# Altium schematic sheet Main.SchDoc: ThunderScope 1000E
size A4; DrawnBy: Aleksa Bjelogrlic; Revision: 1
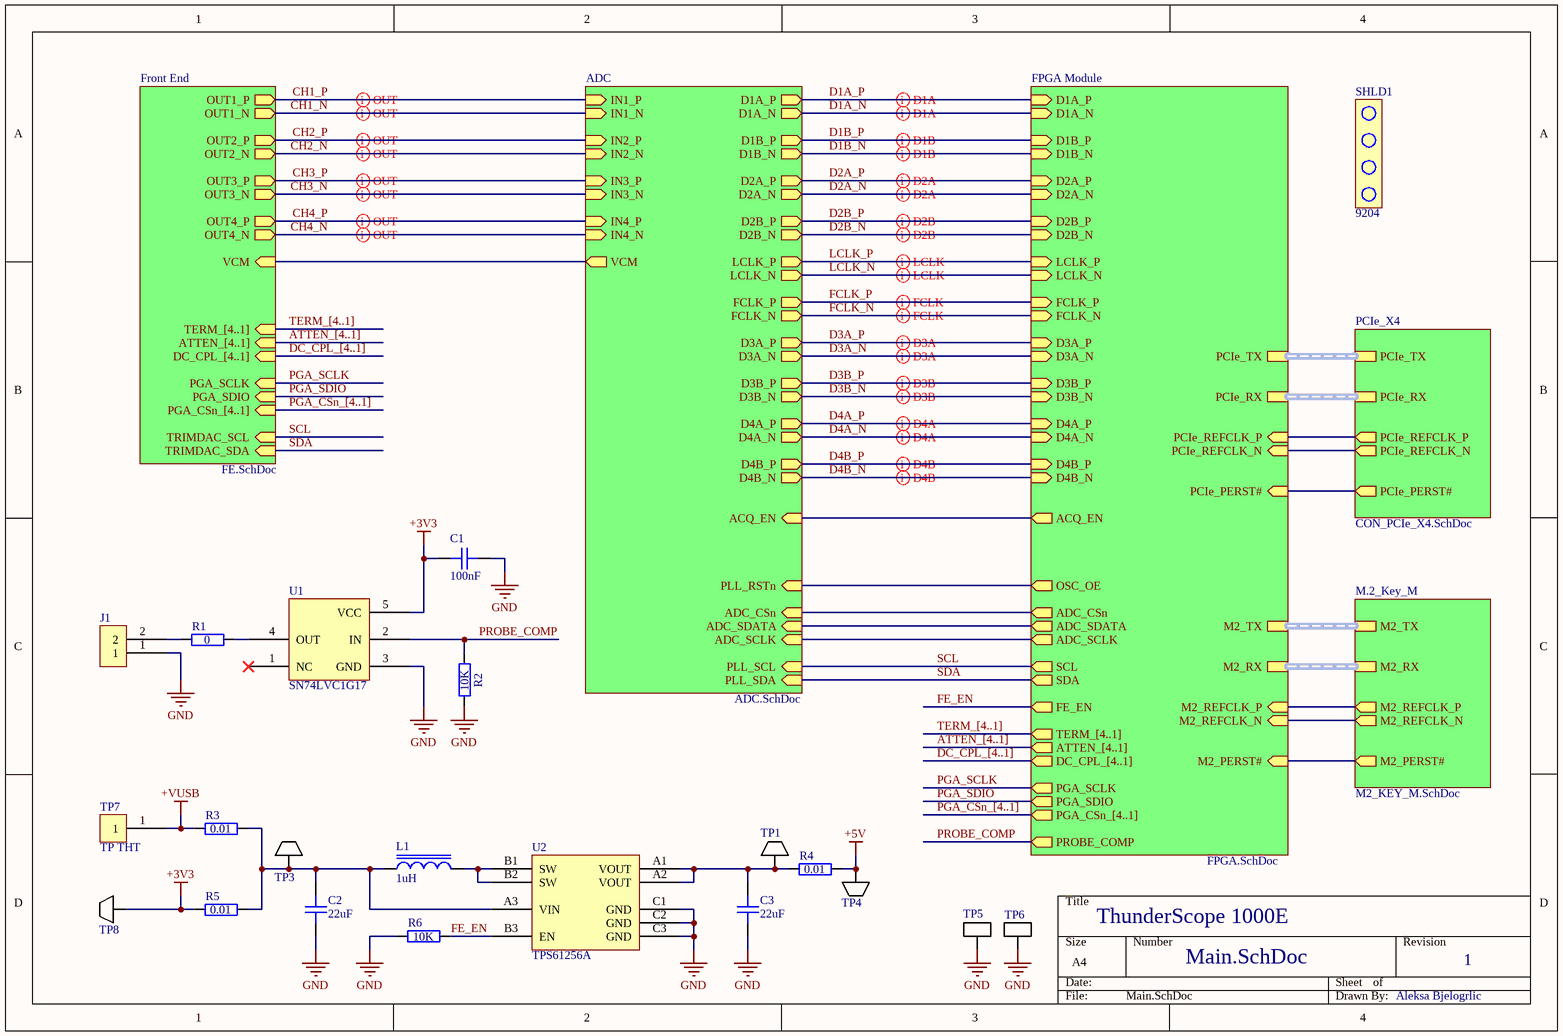
[diagram p0: Main.SchDoc]

## Parts
C1  100nF  [GEN_C_0402]
C2  22uF  [GEN_C_0805]
C3  22uF  [GEN_C_0805]
J1  TSW-101-08-F-D-RA  [GEN_2.54mm_1x2_Pin_TH_RA]  (value not drawn)
L1  1uH  [GEN_L_1210]
R1  0  [GEN_R_0402]
R2  10K  [GEN_R_0402]
R3  0.01  [GEN_R_0603]
R4  0.01  [GEN_R_0603]
R5  0.01  [GEN_R_0603]
R6  10K  [GEN_R_0402]
SHLD1  9204  (mechanical)
TP1  5015  [KEY_5015]  (value not drawn)
TP3  5015  [KEY_5015]  (value not drawn)
TP4  5015  [KEY_5015]  (value not drawn)
TP5  5019  [KEY_5019]  (value not drawn)
TP6  5019  [KEY_5019]  (value not drawn)
TP7  TP THT  [GEN_1_Pin_TH_TP]
TP8  5015  [KEY_5015]  (value not drawn)
U1  SN74LVC1G17  [GEN_SC-70-5]
U2  TPS61256A  [TI_DSBGA_YFF0009]

## Sub-sheets
ADC = ADC.SchDoc: IN4_N (in), IN4_P (in), IN3_N (in), IN3_P (in), IN2_N (in), IN2_P (in), VCM (out), IN1_N (in), IN1_P (in), ADC_CSn (in), ADC_SDATA (in), ADC_SCLK (in), D1A_N (out), D1A_P (out), D1B_P (out), D1B_N (out), D2A_P (out), D2A_N (out), D2B_N (out), D2B_P (out), LCLK_P (out), LCLK_N (out), FCLK_N (out), FCLK_P (out), D3A_P (out), D3A_N (out), D3B_P (out), D3B_N (out), D4A_P (out), D4A_N (out), D4B_P (out), D4B_N (out), ACQ_EN (in), PLL_RSTn (in), PLL_SDA (in), PLL_SCL (in)
FPGA Module = FPGA.SchDoc: D1A_P (in), D1A_N (in), D1B_P (in), D1B_N (in), D2A_P (in), D2A_N (in), D2B_P (in), D2B_N (in), LCLK_P (in), LCLK_N (in), FCLK_P (in), FCLK_N (in), D3A_P (in), D3A_N (in), D3B_P (in), D3B_N (in), D4A_P (in), D4A_N (in), D4B_P (in), D4B_N (in), ACQ_EN (out), OSC_OE (out), ADC_CSn (out), ADC_SDATA (out), ADC_SCLK (out), SCL (out), SDA (out), FE_EN (out), ATTEN_[4..1] (out), DC_CPL_[4..1] (out), PGA_SCLK (out), PGA_SDIO (out), PGA_CSn_[4..1] (out), PROBE_COMP (out), PCIe_REFCLK_N (in), PCIe_PERST# (in), PCIe_REFCLK_P (in), PCIe_TX (harness PCIe_X4_TX), PCIe_RX (harness PCIe_X4_RX), M2_REFCLK_N (in), M2_PERST# (in), M2_REFCLK_P (in), M2_TX (harness M2_X4_TX), M2_RX (harness M2_X4_RX), TERM_[4..1] (out)
Front End = FE.SchDoc: OUT1_P (out), OUT1_N (out), OUT3_P (out), OUT3_N (out), OUT4_N (out), OUT2_N (out), OUT2_P (out), OUT4_P (out), VCM (in), DC_CPL_[4..1] (in), ATTEN_[4..1] (in), PGA_SCLK (in), PGA_CSn_[4..1] (in), PGA_SDIO (in), TRIMDAC_SCL (in), TRIMDAC_SDA (in), TERM_[4..1] (in)
M.2_Key_M = M2_KEY_M.SchDoc: M2_REFCLK_N (out), M2_PERST# (out), M2_REFCLK_P (out), M2_TX (harness M2_X4_TX), M2_RX (harness M2_X4_RX)
PCIe_X4 = CON_PCIe_X4.SchDoc: PCIe_REFCLK_N (out), PCIe_PERST# (out), PCIe_REFCLK_P (out), PCIe_TX (harness PCIe_X4_TX), PCIe_RX (harness PCIe_X4_RX)

## Nets
+3V3: C1.1 R5.2 TP8.1 U1.5(VCC)
+5V: R4.2 TP4.1
+VUSB: R3.2 TP7.1
GND: C1.2 C2.1 C3.1 J1.1 R2.1 R6.2 TP5.1 TP6.1 U1.3(GND) U2.C1(GND) U2.C2(GND) U2.C3(GND)
CH1_N: sheet Front End/OUT1_N, sheet ADC/IN1_N
CH1_P: sheet Front End/OUT1_P, sheet ADC/IN1_P
CH2_N: sheet Front End/OUT2_N, sheet ADC/IN2_N
CH2_P: sheet Front End/OUT2_P, sheet ADC/IN2_P
CH3_N: sheet Front End/OUT3_N, sheet ADC/IN3_N
CH3_P: sheet Front End/OUT3_P, sheet ADC/IN3_P
CH4_N: sheet Front End/OUT4_N, sheet ADC/IN4_N
CH4_P: sheet Front End/OUT4_P, sheet ADC/IN4_P
D1A_N: sheet ADC/D1A_N, sheet FPGA Module/D1A_N
D1A_P: sheet ADC/D1A_P, sheet FPGA Module/D1A_P
D1B_N: sheet ADC/D1B_N, sheet FPGA Module/D1B_N
D1B_P: sheet ADC/D1B_P, sheet FPGA Module/D1B_P
D2A_N: sheet ADC/D2A_N, sheet FPGA Module/D2A_N
D2A_P: sheet ADC/D2A_P, sheet FPGA Module/D2A_P
D2B_N: sheet ADC/D2B_N, sheet FPGA Module/D2B_N
D2B_P: sheet ADC/D2B_P, sheet FPGA Module/D2B_P
D3A_N: sheet ADC/D3A_N, sheet FPGA Module/D3A_N
D3A_P: sheet ADC/D3A_P, sheet FPGA Module/D3A_P
D3B_N: sheet ADC/D3B_N, sheet FPGA Module/D3B_N
D3B_P: sheet ADC/D3B_P, sheet FPGA Module/D3B_P
D4A_N: sheet ADC/D4A_N, sheet FPGA Module/D4A_N
D4A_P: sheet ADC/D4A_P, sheet FPGA Module/D4A_P
D4B_N: sheet ADC/D4B_N, sheet FPGA Module/D4B_N
D4B_P: sheet ADC/D4B_P, sheet FPGA Module/D4B_P
FCLK_N: sheet ADC/FCLK_N, sheet FPGA Module/FCLK_N
FCLK_P: sheet ADC/FCLK_P, sheet FPGA Module/FCLK_P
FE_EN: R6.1 U2.B3(EN) ; sheet FPGA Module/FE_EN
LCLK_N: sheet ADC/LCLK_N, sheet FPGA Module/LCLK_N
LCLK_P: sheet ADC/LCLK_P, sheet FPGA Module/LCLK_P
PGA_SCLK: sheet Front End/PGA_SCLK, sheet FPGA Module/PGA_SCLK
PGA_SDIO: sheet Front End/PGA_SDIO, sheet FPGA Module/PGA_SDIO
PROBE_COMP: R2.2 U1.2(IN) ; sheet FPGA Module/PROBE_COMP
SCL: sheet Front End/TRIMDAC_SCL, sheet ADC/PLL_SCL, sheet FPGA Module/SCL
SDA: sheet Front End/TRIMDAC_SDA, sheet ADC/PLL_SDA, sheet FPGA Module/SDA
NetC2_2: C2.2 L1.1 R3.1 R5.1 TP3.1 U2.A3(VIN)
NetC3_2: C3.2 R4.1 TP1.1 U2.A1(VOUT) U2.A2(VOUT)
NetJ1_2: J1.2 R1.1
NetL1_2: L1.2 U2.B1(SW) U2.B2(SW)
NetR1_2: R1.2 U1.4(OUT)
(unnamed): sheet Front End/VCM, sheet ADC/VCM
(unnamed): sheet ADC/ADC_CSn, sheet FPGA Module/ADC_CSn
(unnamed): sheet ADC/ADC_SDATA, sheet FPGA Module/ADC_SDATA
(unnamed): sheet ADC/ADC_SCLK, sheet FPGA Module/ADC_SCLK
(unnamed): sheet ADC/ACQ_EN, sheet FPGA Module/ACQ_EN
(unnamed): sheet ADC/PLL_RSTn, sheet FPGA Module/OSC_OE
(unnamed): sheet FPGA Module/PCIe_REFCLK_N, sheet PCIe_X4/PCIe_REFCLK_N
(unnamed): sheet FPGA Module/PCIe_PERST#, sheet PCIe_X4/PCIe_PERST#
(unnamed): sheet FPGA Module/PCIe_REFCLK_P, sheet PCIe_X4/PCIe_REFCLK_P
(unnamed): sheet FPGA Module/M2_REFCLK_N, sheet M.2_Key_M/M2_REFCLK_N
(unnamed): sheet FPGA Module/M2_PERST#, sheet M.2_Key_M/M2_PERST#
(unnamed): sheet FPGA Module/M2_REFCLK_P, sheet M.2_Key_M/M2_REFCLK_P

Not connected (* = marked no-connect by the designer): U1 1(NC)*

## Buses and harness runs
bus ATTEN_[4..1] = sheet FPGA Module/ATTEN_[4..1]
bus ATTEN_[4..1] = sheet Front End/ATTEN_[4..1]
bus DC_CPL_[4..1] = sheet FPGA Module/DC_CPL_[4..1]
bus DC_CPL_[4..1] = sheet Front End/DC_CPL_[4..1]
bus PGA_CSn_[4..1] = sheet FPGA Module/PGA_CSn_[4..1]
bus PGA_CSn_[4..1] = sheet Front End/PGA_CSn_[4..1]
bus TERM_[4..1] = sheet FPGA Module/TERM_[4..1]
bus TERM_[4..1] = sheet Front End/TERM_[4..1]
harness sheet FPGA Module/M2_RX = sheet M.2_Key_M/M2_RX
harness sheet FPGA Module/M2_TX = sheet M.2_Key_M/M2_TX
harness sheet FPGA Module/PCIe_RX = sheet PCIe_X4/PCIe_RX
harness sheet FPGA Module/PCIe_TX = sheet PCIe_X4/PCIe_TX

## Layout directives
differential pair: D1A_N, D1A_P, D1B_N, D1B_P, D2A_N, D2A_P, D2B_N, D2B_P, D3A_N, D3A_P, D3B_N, D3B_P, D4A_N, D4A_P, D4B_N, D4B_P, FCLK_N, FCLK_P, LCLK_N, LCLK_P
differential pair; differential pair class 100Z_Diff_PGA: CH1_N, CH1_P, CH2_N, CH2_P, CH3_N, CH3_P, CH4_N, CH4_P

## Notes on the sheet
- Aleksa Bjelogrlic

## Library data of the parts
C1 = CAP 100nF 16V X7R 0402: Voltage Rating: 16V; Package: 0402; Supplier 1: Digi-Key; Supplier Part Number 1: 490-4759-1-ND; Value: 100nF
C2 C3 = CAP 22uF 25V X5R 0805: Voltage Rating: 25V; Package: 0805; Value: 22uF; Supplier 1: Digi-Key; Supplier Part Number 1: 490-10749-1-ND
J1 = CONN 2.54mm 2 Pin TH RA: Supplier 1: Digi-Key; Supplier Part Number 1: SAM12296-ND
L1 = IND 1uH 3.1A 45 MOHM 1210: Value: 1uH; Supplier 1: Digi-Key; Supplier Part Number 1: 490-10590-1-ND
R1 = RES 0 OHM 1/16W 0402: Power Rating: 0.0625W; Package: 0402; Supplier 1: Digi-Key; Supplier Part Number 1: 311-0.0JRCT-ND; Value: 0
R2 R6 = RES 10K OHM 1% 1/10W 0402: Tolerance: 1%; Power Rating: 0.1W; Package: 0402; Supplier 1: Digi-Key; Supplier Part Number 1: P10.0KLCT-ND; Value: 10K
R3-R5 = RES 0.01 OHM 1% 1/4W 0603: Tolerance: 1%; Power Rating: 0.25W; Supplier 1: Digi-Key; Supplier Part Number 1: 408-1404-1-ND; Value: 0.01; Package: 0603
SHLD1 = PCIe IO Shield: Supplier 1: Mouser; Supplier Part Number 1: 534-9204
TP1 TP3 TP4 TP8 = TP KEYSTONE 5015: Supplier 1: Digi-Key; Supplier Part Number 1: 36-5015CT-ND
TP5 TP6 = TP KEYSTONE 5019: Supplier 1: Digi-Key; Supplier Part Number 1: 36-5019CT-ND
U1 = IC BUFFER SN74LVC1G17: Supplier 1: Digi-Key; Supplier Part Number 1: 296-11934-1-ND
U2 = IC BOOST TPS61256A: Supplier 1: Digi-Key; Supplier Part Number 1: 296-48833-1-ND